# Altium schematic sheet MCU.SchDoc
size A4
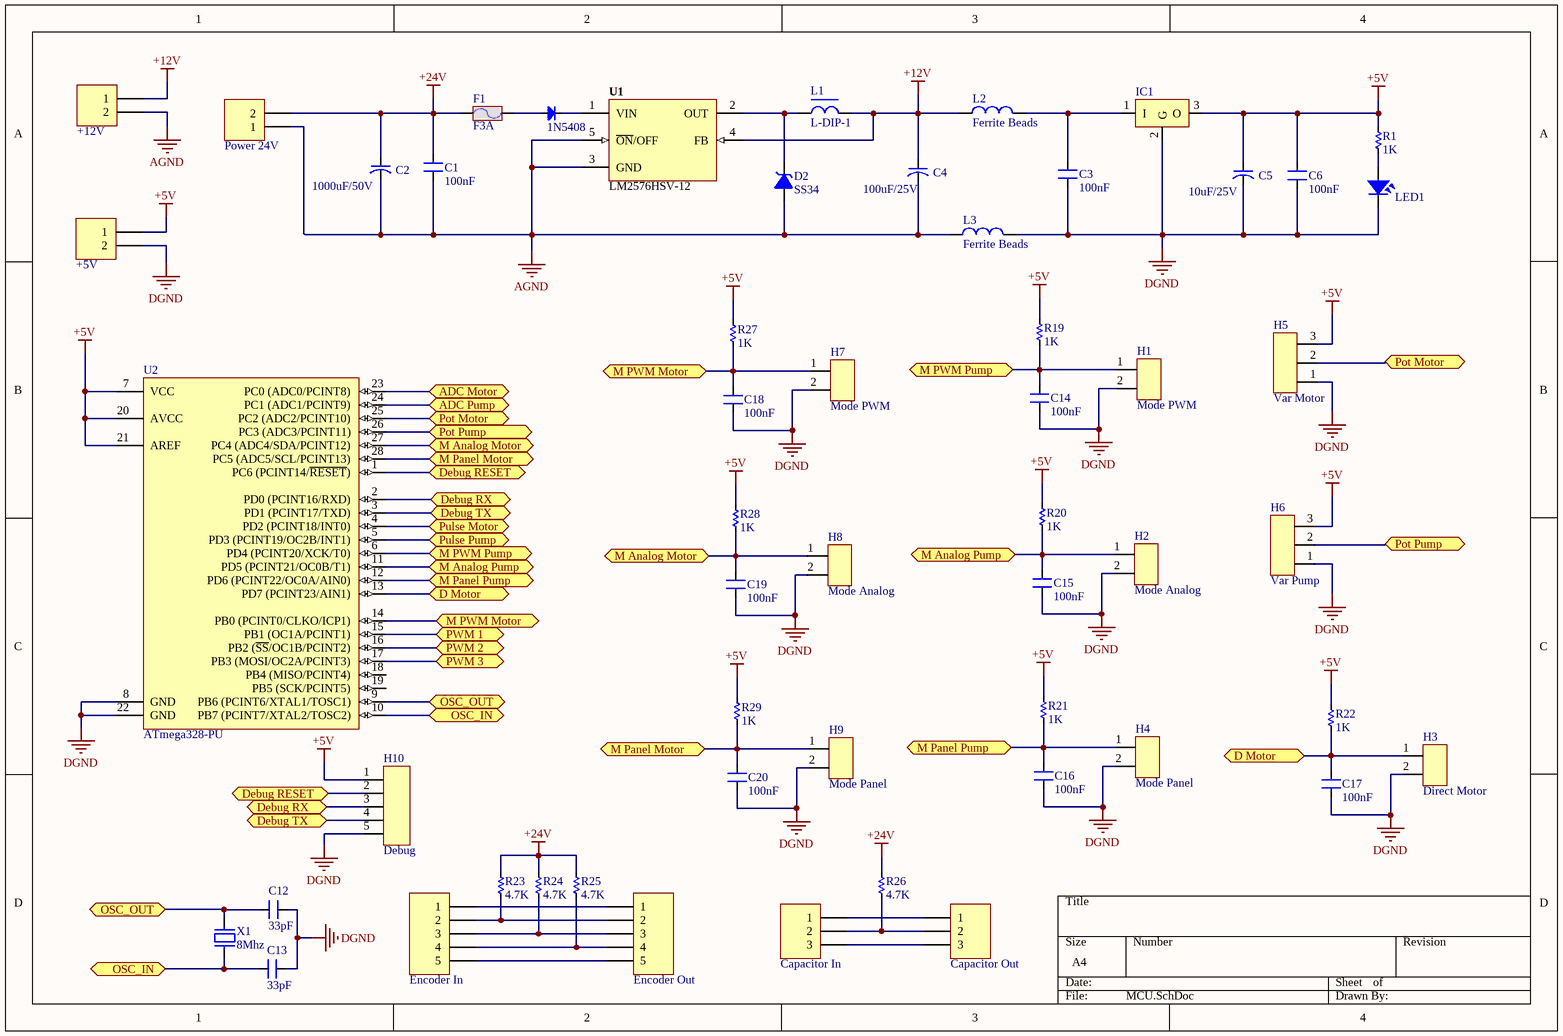
[diagram p0: MCU.SchDoc]

## Parts
1N5408  Diode  [DIO-3A]  (value not drawn)
+5V  Domino 2H  [DOMINO 2-5mm -H]  (value not drawn)
+12V  Domino 2H  [DOMINO 2-5mm -H]  (value not drawn)
C1  100nF  [CN1.5]
C2  1000uF/50V  [D12.5xL20]
C3  100nF  [CN1.5]
C4  100uF/25V  [D5xL16]
C5  10uF/25V  [D5xL16]
C6  100nF  [CN1.5]
C12  33pF  [CN-SMD-0805]
C13  33pF  [CN-SMD-0805]
C14  100nF  [CN-SMD-0805]
C15  100nF  [CN-SMD-0805]
C16  100nF  [CN-SMD-0805]
C17  100nF  [CN-SMD-0805]
C18  100nF  [CN-SMD-0805]
C19  100nF  [CN-SMD-0805]
C20  100nF  [CN-SMD-0805]
Capacitor_In  Domino 3H  [DOMINO 3 - 5mm-H]  (value not drawn)
Capacitor_Out  Domino 3H  [DOMINO 3 - 5mm-H]  (value not drawn)
D2  SS34  [SS34]
Encoder_In  Domino 5  [DOMINO 5 - 5mm]  (value not drawn)
Encoder_Out  Domino 5  [DOMINO 5 - 5mm]  (value not drawn)
F1  F3A  [Fuse3]
H1  Mode PWM  [Header Bus 2]
H2  Mode Analog  [Header Bus 2]
H3  Direct Motor  [Header Bus 2]
H4  Mode Panel  [Header Bus 2]
H5  Var Motor  [Header Bus 3]
H6  Var Pump  [Header Bus 3]
H7  Mode PWM  [Header Bus 2]
H8  Mode Analog  [Header Bus 2]
H9  Mode Panel  [Header Bus 2]
H10  Debug  [Header 5]
IC1  LM78xx  [TO220-123]  (value not drawn)
L1  L-DIP-1  [L-DIP-M-14x7]
L2  Ferrite Beads  [RES-SMD-0805]
L3  Ferrite Beads  [RES-SMD-0805]
LED1  LED  [LED-0805-Red]  (value not drawn)
Power_24V  Domino 2H  [DOMINO 2-5mm -H]  (value not drawn)
R1  1K  [RES-SMD-0805]
R19  1K  [RES-SM-0805]
R20  1K  [RES-SM-0805]
R21  1K  [RES-SM-0805]
R22  1K  [RES-SM-0805]
R23  4.7K  [RES-SM-0805]
R24  4.7K  [RES-SM-0805]
R25  4.7K  [RES-SM-0805]
R26  4.7K  [RES-SM-0805]
R27  1K  [RES-SM-0805]
R28  1K  [RES-SM-0805]
R29  1K  [RES-SM-0805]
U1  LM2576HSV-12  [DIP5]
U2  ATmega328-PU  [DIP28]
X1  8Mhz  [XT2-SMD]

## Ports
ADC Motor (bidir), ADC Pump (bidir), D Motor (bidir), Debug RESET (bidir), Debug RX (bidir), Debug TX (bidir), M Analog Motor (bidir), M Analog Pump (bidir), M Panel Motor (bidir), M Panel Pump (bidir), M PWM Motor (bidir), M PWM Pump (bidir), OSC_IN (bidir), OSC_OUT (bidir), Pot Motor (bidir), Pot Pump (bidir), Pulse Motor (bidir), Pulse Pump (bidir), PWM 1 (bidir), PWM 2 (bidir), PWM 3 (bidir)

## Nets
+5V: +5V.1 C5.1 C6.2 H5.3 H6.3 H10.1 IC1.3(O) R1.1 R19.1 R20.1 R21.1 R22.1 R27.1 R28.1 R29.1 U2.7(VCC) U2.20(AVCC) U2.21(AREF)
+12V: +12V.1 C4.1 L1.2 L2.1 U1.4(FB)
+24V: C1.2 C2.1 F1.1 Power_24V.2 R23.1 R24.1 R25.1 R26.1
AGND: +12V.2 C1.1 C2.2 C4.2 D2.2(A) L3.1 Power_24V.1 U1.3(GND) U1.5(~{ON}/OFF)
DGND: +5V.2 C3.1 C5.2 C6.1 C12.1 C13.1 C14.1 C15.1 C16.1 C17.1 C18.1 C19.1 C20.1 H1.2 H2.2 H3.2 H4.2 H5.1 H6.1 H7.2 H8.2 H9.2 H10.5 IC1.2(G) L3.2 LED1.2 U2.8(GND) U2.22(GND)
ADC Motor: U2.23(PC0_(ADC0/PCINT8)) ; port ADC Motor
ADC Pump: U2.24(PC1_(ADC1/PCINT9)) ; port ADC Pump
D Motor: C17.2 H3.1 R22.2 U2.13(PD7_(PCINT23/AIN1)) ; port D Motor
Debug RESET: H10.2 U2.1(PC6_(PCINT14/~{RESET})) ; port Debug RESET
Debug RX: H10.3 U2.2(PD0_(PCINT16/RXD)) ; port Debug RX
Debug TX: H10.4 U2.3(PD1_(PCINT17/TXD)) ; port Debug TX
M Analog Motor: C19.2 H8.1 R28.2 U2.27(PC4_(ADC4/SDA/PCINT12)) ; port M Analog Motor
M Analog Pump: C15.2 H2.1 R20.2 U2.11(PD5_(PCINT21/OC0B/T1)) ; port M Analog Pump
M Panel Motor: C20.2 H9.1 R29.2 U2.28(PC5_(ADC5/SCL/PCINT13)) ; port M Panel Motor
M Panel Pump: C16.2 H4.1 R21.2 U2.12(PD6_(PCINT22/OC0A/AIN0)) ; port M Panel Pump
M PWM Motor: C18.2 H7.1 R27.2 U2.14(PB0_(PCINT0/CLKO/ICP1)) ; port M PWM Motor
M PWM Pump: C14.2 H1.1 R19.2 U2.6(PD4_(PCINT20/XCK/T0)) ; port M PWM Pump
OSC_IN: C13.2 U2.10(PB7_(PCINT7/XTAL2/TOSC2)) X1.1 ; port OSC_IN
OSC_OUT: C12.2 U2.9(PB6_(PCINT6/XTAL1/TOSC1)) X1.2 ; port OSC_OUT
Pot Motor: H5.2 U2.25(PC2_(ADC2/PCINT10)) ; port Pot Motor
Pot Pump: H6.2 U2.26(PC3_(ADC3/PCINT11)) ; port Pot Pump
Pulse Motor: U2.4(PD2_(PCINT18/INT0)) ; port Pulse Motor
Pulse Pump: U2.5(PD3_(PCINT19/OC2B/INT1)) ; port Pulse Pump
PWM 1: U2.15(PB1_(OC1A/PCINT1)) ; port PWM 1
PWM 2: U2.16(PB2_(~{SS}/OC1B/PCINT2)) ; port PWM 2
PWM 3: U2.17(PB3_(MOSI/OC2A/PCINT3)) ; port PWM 3
Net1N5408_1: 1N5408.1(A) F1.2
Net1N5408_2: 1N5408.2(K) U1.1(VIN)
NetC3_2: C3.2 IC1.1(I) L2.2
NetCapacitor_In_1: Capacitor_In.1 Capacitor_Out.1
NetCapacitor_In_2: Capacitor_In.2 Capacitor_Out.2 R26.2
NetCapacitor_In_3: Capacitor_In.3 Capacitor_Out.3
NetD2_1: D2.1(K) L1.1 U1.2(OUT)
NetEncoder_In_1: Encoder_In.1 Encoder_Out.1
NetEncoder_In_2: Encoder_In.2 Encoder_Out.2 R23.2
NetEncoder_In_3: Encoder_In.3 Encoder_Out.3 R24.2
NetEncoder_In_4: Encoder_In.4 Encoder_Out.4 R25.2
NetEncoder_In_5: Encoder_In.5 Encoder_Out.5
NetLED1_1: LED1.1 R1.2

Not connected (* = marked no-connect by the designer): U2 18(PB4_(MISO/PCINT4)) 19(PB5_(SCK/PCINT5))

## Library data of the parts
1N5408 = Diode: Default Diode; Code - JEDEC: DO-214-AB; Value: 1N5007; Published: 8-Jun-2000; Revision: July-2002: Re-released for DXP Platform.; Publisher: Altium Limited
+5V +12V Power_24V = Domino 2H: Domino 2-Pin, Right Angle; LatestRevisionDate: 17-Jul-2002; LatestRevisionNote: Re-released for DXP Platform.; Publisher: Altium Limited
C1 C3 C6 C14-C20 = CN: Value: 33pF
C2 C4 C5 = Polary Capacitor: DIP Footprint
C12 C13 = CN: Value: 33pF
Capacitor_In Capacitor_Out = Domino 3H: Domino 3-Pin, Right Angle; LatestRevisionDate: 17-Jul-2002; LatestRevisionNote: Re-released for DXP Platform.; Publisher: Altium Limited
Encoder_In Encoder_Out = Domino 5: Domino 5-Pin; LatestRevisionDate: 17-Jul-2002; LatestRevisionNote: Re-released for DXP Platform.; Publisher: Altium Limited
F1 = Fuse: Designed by: VanDungEvn; Value: Fuse
H1-H4 H7-H9 = Header 2x1
H5 H6 = Header 3x1
H10 = Header 5x1
IC1 = LM78xx: Positive Voltage Regulator; Note: Tab is connected to pin 3 (GND).; Published: 24-Aug-2001; LatestRevisionDate: 17-Jul-2002; LatestRevisionNote: Re-released for DXP Platform.; DatasheetVersion: Apr-1994; PackageVersion: Jul-1998; PackageReference: ISOWATT220AB; Publisher: Altium Limited; PackageDescription: TO, Thru-Hole, Vertical, Heatsink Mounted; 3 In-Line Leads; Pitch 2.54 mm; Pin sequence 1, 3, 2; ComponentLink1Description: Manufacturer Link; ComponentLink1URL: http://www.st.com/; ComponentLink2Description: Datasheet; ComponentLink2URL: http://www.st.com/stonline/products/literature/ds/2146/l78m05c.pdf
L1 = L-DIP-1: Inductor; Value: 150 mH
LED1 = LED: LED Single colour Green and Red; Value: LED 3 ly Single Colour
R1 R19-R29 = Res: Manufacturer: Generic Components; Class: Passive; SubClass: R; Published: 08/06/2000; Publisher: Altium Hobart Technology Centre
U1 = LM2576: Max Input Voltage: 12 V; Max Output Current: 3 (6.0 peak) A; Max Output Voltage: mV; Category: IC-Power; Min Input Voltage: mV; Min Output Voltage: mV; Mounting Technology: Surface Mount; Status: Unreleased; Supply Voltage: mV; Temperature Range: -40 to +125 degC
U2 = ATmega328-PU: 8-bit AVR Microcontroller, 32KB Flash, 1KB EEPROM, 2KB SRAM, 28-pin PDIP, Industrial Grade (-40°C to 85°C); Published: 1-Apr-2010; DatasheetVersion: revA, Jan-2010; PackageVersion: revB, Sep-2001; PackageReference: 28P3; Publisher: Altium Limited; PackageDescription: 28-lead (0.300"/7.62mm Wide) Plastic Dual Inline Package (PDIP); Supplier 1: Digi-Key; Supplier Part Number 1: ATMEGA328-PU-ND; Supplier 2: Mouser; Supplier Part Number 2: 556-ATMEGA328-PU; ComponentLink1Description: Manufacturer Link; ComponentLink1URL: http://www.atmel.com/products/avr/default.asp?; ComponentLink2Description: ATmega48A/48PA/88A/88PA/168A/168PA/328/328P Datasheet; ComponentLink2URL: http://www.atmel.com/dyn/resources/prod_documents/8271.pdf; ComponentLink3Description: ATmega48A/48PA/88A/88PA/168A/168PA/328/328P Summary; ComponentLink3URL: http://www.atmel.com/dyn/resources/prod_documents/8271S.pdf; ComponentLink4Description: Atmel.com Home; ComponentLink4URL: http://www.atmel.com
X1 = XT2: Crystal, 32.768 KHz, -40 to 85 degC, 3.2 x 1.5 x 0.9 mm SMD; Value: 4Mhz